# EAGLE design Cathode Coupled Oscillator (EAGLE 7.6.0)
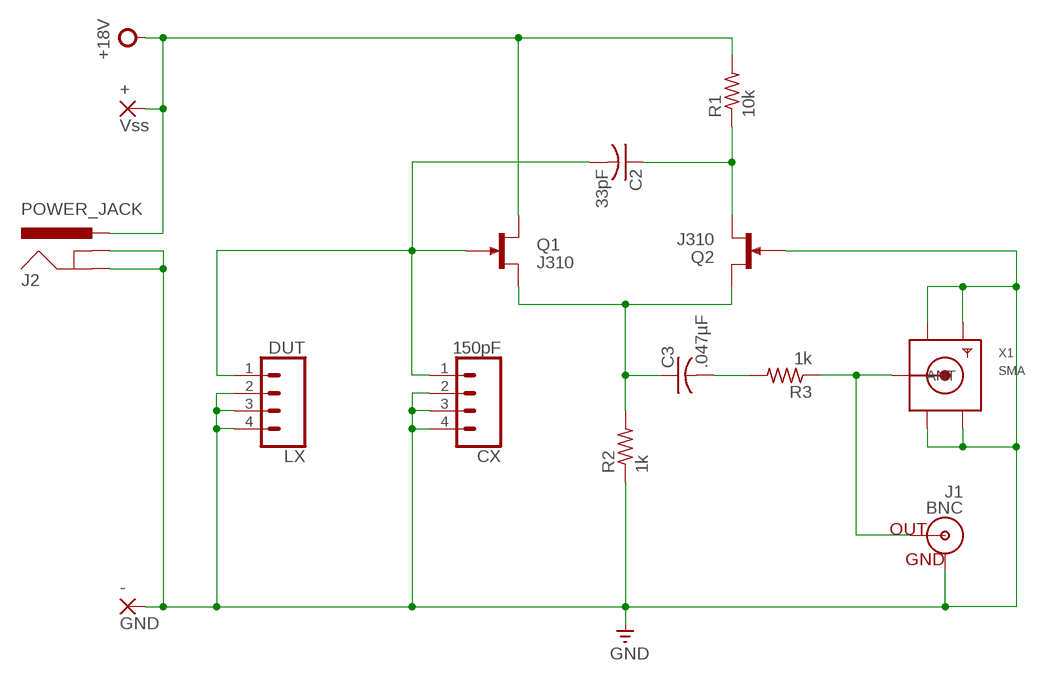
[diagram p0: schematic, sheet 1]

## Parts
+  Vss  2,54/1,0  [2,54/1,0]
-  GND  2,54/1,0  [2,54/1,0]
C2  33pF  C-USC0805  [C0805]
C3  .047µF  C-USC0805  [C0805]
CX  150pF  CONN_04  [1X04]
J1  BNC  BNCPTH  [BNC]
J2  POWER_JACK  [POWER_JACK_PTH]
LX  DUT  CONN_04  [1X04]
Q1  J310  MMBFJ3  [SOT23]
Q2  J310  MMBFJ3  [SOT23]
R1  10k  R-US_R0805  [R0805]
R2  1k  R-US_R0805  [R0805]
R3  1k  R-US_R0805  [R0805]
X1  SMA  SMACONNECTOR  [SMA90_DIP]

## Nets
+18V: +.1(P) J2.PWR Q1.1(D) R1.2
GND: -.1(P) CX.2 CX.3 CX.4 J1.GND J2.GND J2.GNDBREAK LX.2 LX.3 LX.4 Q2.3(G) R2.1 X1.GND1 X1.GND2 X1.GND3 X1.GND4
N$3: C2.1 Q2.2(S) R1.1
N$4: C2.2 CX.1 LX.1 Q1.3(G)
N$5: J1.S(OUT) R3.1 X1.ANTENNA(ANT)
N$6: C3.2 R3.2
N$7: C3.1 Q1.2(S) Q2.1(D) R2.2

## Library data of the parts
+ - = wirepad:2,54/1,0: THROUGH-HOLE PAD
C2 C3 = rcl:C-US: CAPACITOR, American symbol
CX LX = SparkFun-Connectors:CONN_04: Multi connection point. Often used as Generic Header-pin footprint for 0.1 inch spaced/style header connections On any of the 0.1 inch spaced packages, you can populate with these: Break Away Headers - Straight <https://www.sparkfun.com/products/116> (PRT-00116) Break Away Male Headers - Right Angle <https://www.sparkfun.com/products/553> (PRT-00553) Female Headers <https://www.sparkfun.com/products/115> (PRT-00115) Break Away Headers - Machine Pin <https://www.sparkfun.com/products/117> (PRT-00117) Break Away Female Headers - Swiss Machine Pin <https://www.sparkfun.com/products/743> (PRT-00743) For SCREWTERMINALS and SPRING TERMINALS visit here: Screw Terimnals on SparkFun.com <https://www.sparkfun.com/search/results?term=Screw+Terminals> (5mm/3.5mm/2.54mm spacing) This device is also useful as a general connection point to wire up your design to another part of your project. Our various solder wires solder well into these plated through hole pads. Hook-Up Wire - Assortment (Stranded, 22 AWG) <https://www.sparkfun.com/products/11375> (PRT-11375) Hook-Up Wire - Assortment (Solid Core, 22 AWG) <https://www.sparkfun.com/products/11367> (PRT-11367) View the entire wire category on our website here <https://www.sparkfun.com/categories/141> Special notes: Molex polarized connector foot print use with SKU : PRT-08231 with associated crimp pins and housings. 1MM SMD Version SKU: PRT-10208; PROD_ID: CONN-09696
J1 = SparkFun-Connectors:BNC: BNC Right Angle Connector Mouser Part# 5227161 SparkFun Products: BNC Connector - Right Angle <https://www.sparkfun.com/products/10550>; PROD_ID: LPA-12729; SF_ID: PRT-10550
J2 = SparkFun-Connectors:POWER_JACK: Power Jack Connector This is the standard 5.5mm barrel jack for power. The PTH is the most common, proven, reliable, footprint. The Slot footprint only works if the mill layer is transmitted to the PCB fab house so be warned. Here are the connectors we sell at SparkFun: DC Barrel Power Jack/Connector <https://www.sparkfun.com/products/119> (PRT-00119) DC Barrel Power Jack/Connector (SMD) <https://www.sparkfun.com/products/12748> (PRT-12748) DC Barrel Jack Adapter - Breadboard Compatible <https://www.sparkfun.com/products/10811> (PRT-10811) It is used on this SparkFun product (and many, many others): SparkFun RedBoard - Programmed with Arduino <https://www.sparkfun.com/products/12757> (DEV-12757) Also, if you need a mating power supply or connector, please check these out: Wall Adapter Power Supply - 9VDC 650mA <https://www.sparkfun.com/products/298> (TOL-00298) DC Barrel Jack Adapter - Male <https://www.sparkfun.com/products/10287> (PRT-10287); PROD_ID: CONN-08197
Q1 Q2 = transistor-small-signal:MMBFJ3*: N-Channel RF Amplifier Source: http://www.fairchildsemi.com/pf/J3/J310.html
R1-R3 = rcl:R-US_: RESISTOR, American symbol
X1 = adafruit:SMACONNECTOR: SMA Connector 90° DIP SMA Connector, 50 Ohm (4UConnector: 07259)

## Board
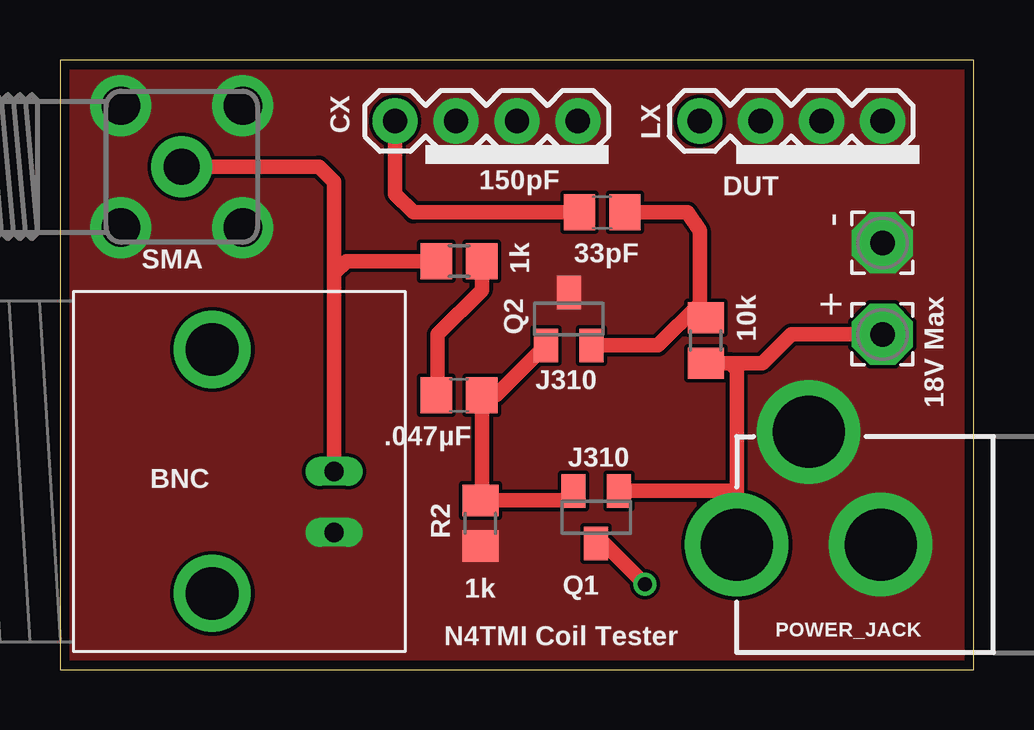
[diagram p1: board, top side]
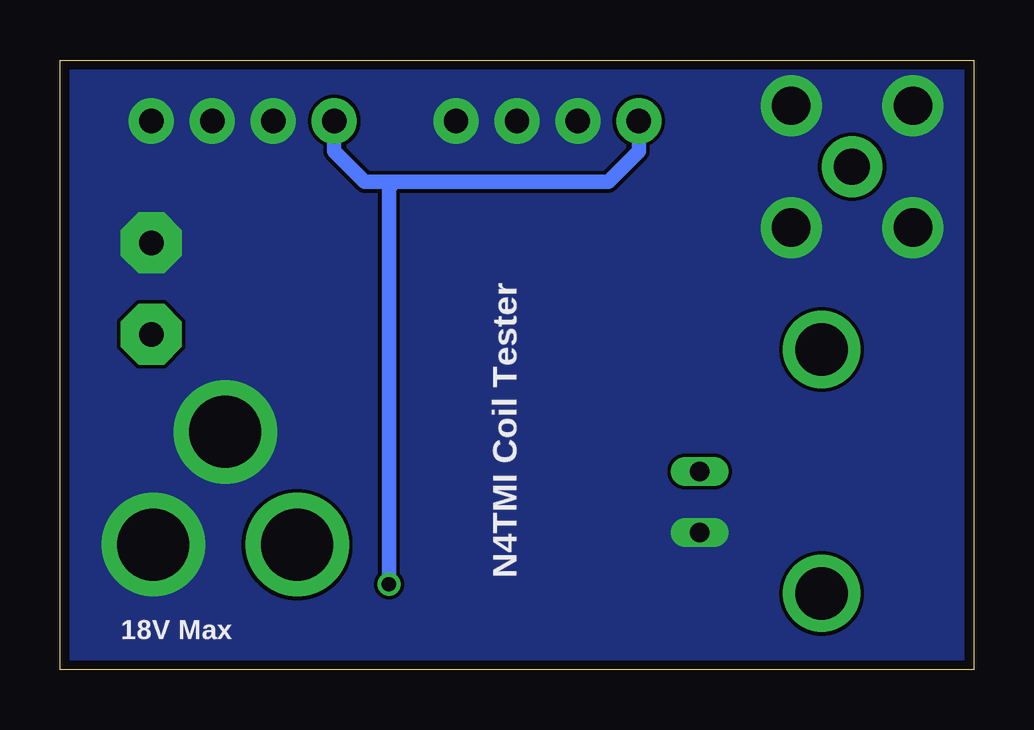
[diagram p2: board, bottom side, seen from below]

Size 38.1 x 25.4 mm. Coordinates in mm from the lower left corner, seen from the top.
Outline: 0,0 38.1,0 38.1,25.4 0,25.4 0,0
Copper layers (1*16): Top 0.0356mm / dielectric 1.5011mm / Bottom 0.0356mm
Design rules "oshpark-2layer": minimum track width 6mil, minimum drill 13mil, track to track 6mil, track to pad 6mil, pad to pad 6mil, via to via 6mil, smd to smd 6mil, copper to edge 15mil, drill to drill 6mil, minimum pad ring 7mil, minimum via ring 7mil, stop-mask expansion 2.5mil, vias tented up to drill 0mil, thermal gap 10mil

### Footprints (pad centres in the part's own frame; a part is rotated, then mirrored left to right if it is on the bottom)
2,54/1,0 = drill 1.016 pad 2.54 octagon: 1 0,0
C0805 = smd 1.3 x 1.5: 1 -0.95,0; 2 0.95,0
1X04 = drill 1.016 pad 1.88: 1 0,0; 2 2.54,0; 3 5.08,0; 4 7.62,0
BNC = drill 2.2: 3 -5.08,5.08; 4 5.08,5.08 | drill 0.8 long: GND -2.54,0; S 0,0
POWER_JACK_PTH = drill 2.997 pad 4.318: GND 0,7.7; GNDBREAK 4.7,10.7; PWR 0,13.7
SOT23 = smd 1 x 1.4: 1 -0.95,-1.1; 2 0.95,-1.1; 3 0,1.1
R0805 = smd 1.3 x 1.5: 1 -0.95,0; 2 0.95,0
SMA90_DIP = drill 1.5 pad 2.54: ANTENNA 0,0 | drill 1.6 pad 2.54: GND1 -2.54,2.54; GND2 2.54,2.54; GND3 -2.54,-2.54; GND4 2.54,-2.54

### Placement (x,y rotation side)
+  34.29,13.97 180 top
-  34.29,17.78 180 top
C2  22.61,19.05 180 top
C3  16.64,11.43 180 top
CX  13.97,22.86 0 top
J1  11.43,8.26 90 top
J2  41.91,5.21 90 top
LX  26.67,22.86 0 top
Q1  22.35,6.35 180 top
Q2  21.21,14.61 0 top
R1  26.92,13.72 270 top
R2  17.53,6.1 90 top
R3  16.64,17.02 0 top
X1  5.08,20.95 90 top

### Tracks (layer width: path | path; a pad name or v marks a point on that pad's centre or on a via)
+18V
  Top 0.61: R1.2 27.94,12.77 | 27.94,12.77 29.28,12.77 30.48,13.97 +.1 | J2.PWR 28.21,7.62 | 28.21,7.62 28.21,12.5 27.94,12.77 | Q1.1 28.04,7.45 28.21,7.62
GND
  pour Top (no thermals): 0,0 38.1,0 38.1,25.4 0,25.4
  pour Bottom (no thermals): 0,0 38.1,0 38.1,25.4 0,25.4
N$3
  Top 0.61: C2.1 26.16,19.05 26.67,18.29 26.67,15.24 | 26.67,15.24 26.67,14.92 R1.1 | Q2.2 24.93,13.51 26.67,15.24
N$4  (via drill 0.6)
  Top 0.61: C2.2 14.73,19.05 13.97,19.81 CX.1 | Q1.3 22.69,5.25 v24.38,3.56
  Bottom 0.61: LX.1 26.67,21.59 25.4,20.32 24.13,20.32 | 24.13,20.32 15.24,20.32 13.97,21.59 CX.1 | v24.38,3.56 24.38,20.07 24.13,20.32
N$5
  Top 0.61: X1.ANTENNA 10.79,20.95 11.43,20.32 11.43,16.51 | 11.43,16.51 J1.S | R3.1 11.94,17.02 11.43,16.51
N$6
  Top 0.61: R3.2 17.59,15.81 15.75,13.97 15.75,11.49 C3.2
N$7
  Top 0.61: Q2.1 18.18,11.43 C3.1 17.59,7.11 R2.2 21,7.05 Q1.2

### Text on the board
tNames: 18V Max | N4TMI Coil Tester
bNames: N4TMI Coil Tester | 18V Max